# Altium schematic sheet USB.SchDoc
size A4
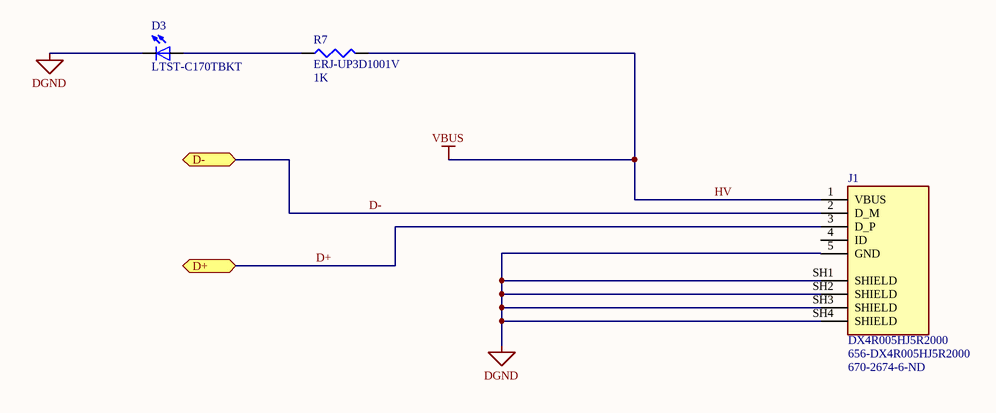
[diagram p0: USB.SchDoc]

## Parts
D3  LTST-C170TBKT  [DIOC200X125X110]
J1  DX4R005HJ5R2000  Supplier Part Number 1: 656-DX4R005HJ5R2000  Supplier Part Number 2: 670-2674-6-ND  [JAE_DX4R005HJ5R2000]
R7  ERJ-UP3D1001V  value 1K  [J1-0603]

## Ports
D+ (bidir), D- (bidir)

## Nets
DGND: D3.NEG J1.5(GND) J1.SH1(SHIELD) J1.SH2(SHIELD) J1.SH3(SHIELD) J1.SH4(SHIELD)
HV: J1.1(VBUS) R7.2  [also labelled VBUS]
D+: J1.3(D_P) ; port D+
D-: J1.2(D_M) ; port D-
NetD3_POS: D3.POS R7.1

Not connected (* = marked no-connect by the designer): J1 4(ID)

## Library data of the parts
D3 = LTST-C170TBKT: Blue 470nm LED Indication - Discrete 3.3V 0805 _2012 Metric_; MF: Lite-On Inc.; SnapEDA_Link: https://www.snapeda.com/parts/LTST-C170TBKT/Lite-On%20Inc./view-part/217848/?ref=snap; MP: LTST-C170TBKT; Value: *; Digi-Key_Part_Number: 160-1579-1-ND; Digi-Key_Purchase_URL: https://www.digikey.jp/product-detail/en/lite-on-inc/LTST-C170TBKT/160-1579-1-ND/564889?utm_source=snapeda&utm_medium=aggregator&utm_campaign=symbol; Package: 0805 Lite-On; Supplier 1: Digi-Key; Supplier Part Number 1: 160-1579-1-ND; Supplier 2: RSComponents; Supplier Part Number 2: 6920913; Supplier 3: Mouser; Supplier Part Number 3: 859-LTST-C170TBKT
J1 = DX4R005HJ5R2000: USB - micro B USB 2.0 Receptacle Connector 5 Position Surface Mount, Right Angle; MF: JAE Electronics; Value: *; Price: None; Package: None; SnapEDA_Link: https://www.snapeda.com/parts/DX4R005HJ5R2000/JAE%20Electronics/view-part/554854/?ref=snap; Availability: Unavailable; MP: DX4R005HJ5R2000; Supplier 1: Mouser; Supplier 2: Digi-Key
R7 = Res3: Resistor; Published: 8-Jun-2000; LatestRevisionDate: 29-May-2009; LatestRevisionNote: IPC-7351 Footprint Added.; PackageReference: J1-0603; Publisher: Altium Limited; PackageDescription: Chip Resistor; Supplier 1: Mouser; Supplier Part Number 1: 667-ERJ-UP3D1001V